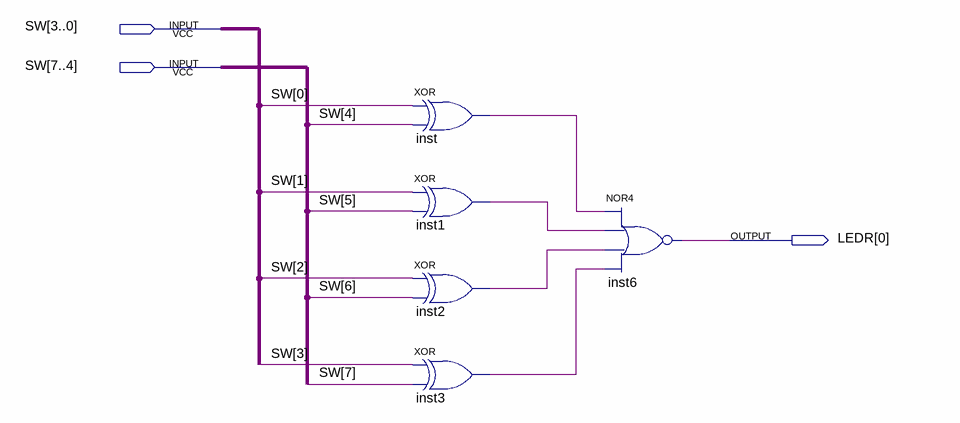
[diagram p0: schematic sheet]
// Quartus schematic z_7.bdf as structural Verilog: 5 symbols, 3 pins
module z_7 (
  input  [7:0] SW,
  output [0:0] LEDR
);

  wire inst1_out, inst2_out, inst3_out, inst_out;

  xor inst (inst_out, SW[0], SW[4]);
  xor inst1 (inst1_out, SW[1], SW[5]);
  xor inst2 (inst2_out, SW[2], SW[6]);
  xor inst3 (inst3_out, SW[3], SW[7]);
  nor inst6 (LEDR[0], inst_out, inst1_out, inst2_out, inst3_out);
endmodule
